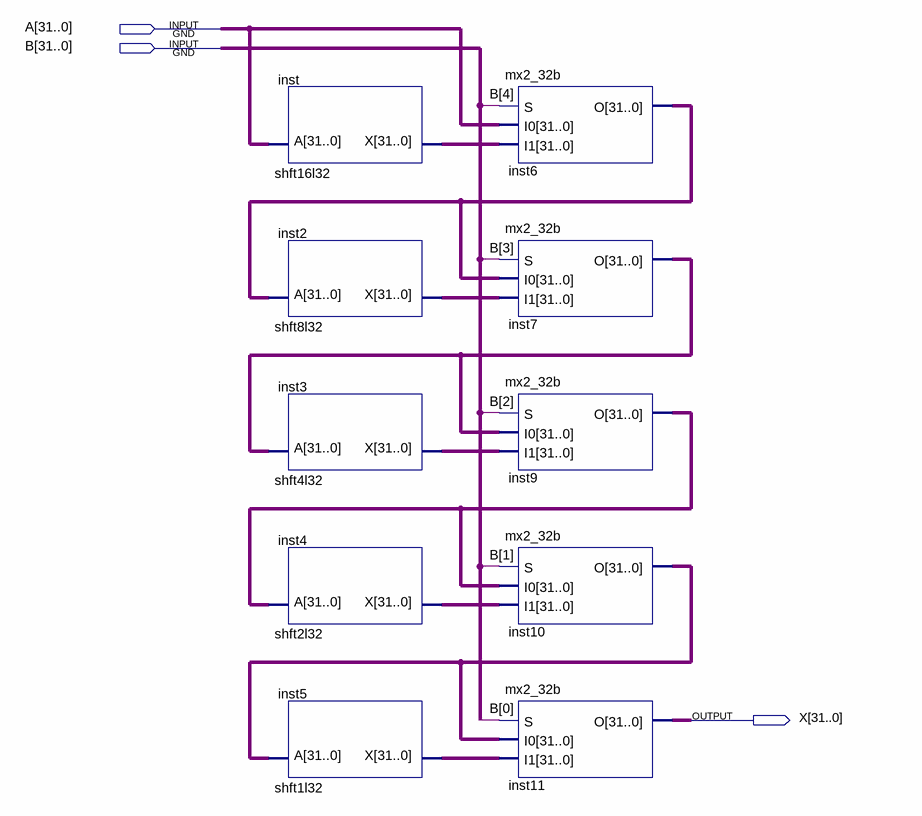
[diagram p0: schematic sheet]
// Quartus schematic shftl32.bdf as structural Verilog: 10 symbols, 3 pins
module shftl32 (
  input  [31:0] A,
  input  [31:0] B,
  output [31:0] X
);

  wire [31:0] inst2_x, inst3_x, inst4_x, inst5_x, inst6_o, inst7_o, inst9_o, inst10_o, inst_x;

  shft16l32 inst (.A(A), .X(inst_x));
  shft8l32 inst2 (.A(inst6_o), .X(inst2_x));
  shft4l32 inst3 (.A(inst7_o), .X(inst3_x));
  shft2l32 inst4 (.A(inst9_o), .X(inst4_x));
  shft1l32 inst5 (.A(inst10_o), .X(inst5_x));
  mx2_32b inst6 (.S(B[4]), .I0(A), .I1(inst_x), .O(inst6_o));
  mx2_32b inst7 (.S(B[3]), .I0(inst6_o), .I1(inst2_x), .O(inst7_o));
  mx2_32b inst9 (.S(B[2]), .I0(inst7_o), .I1(inst3_x), .O(inst9_o));
  mx2_32b inst10 (.S(B[1]), .I0(inst9_o), .I1(inst4_x), .O(inst10_o));
  mx2_32b inst11 (.S(B[0]), .I0(inst10_o), .I1(inst5_x), .O(X));
endmodule
